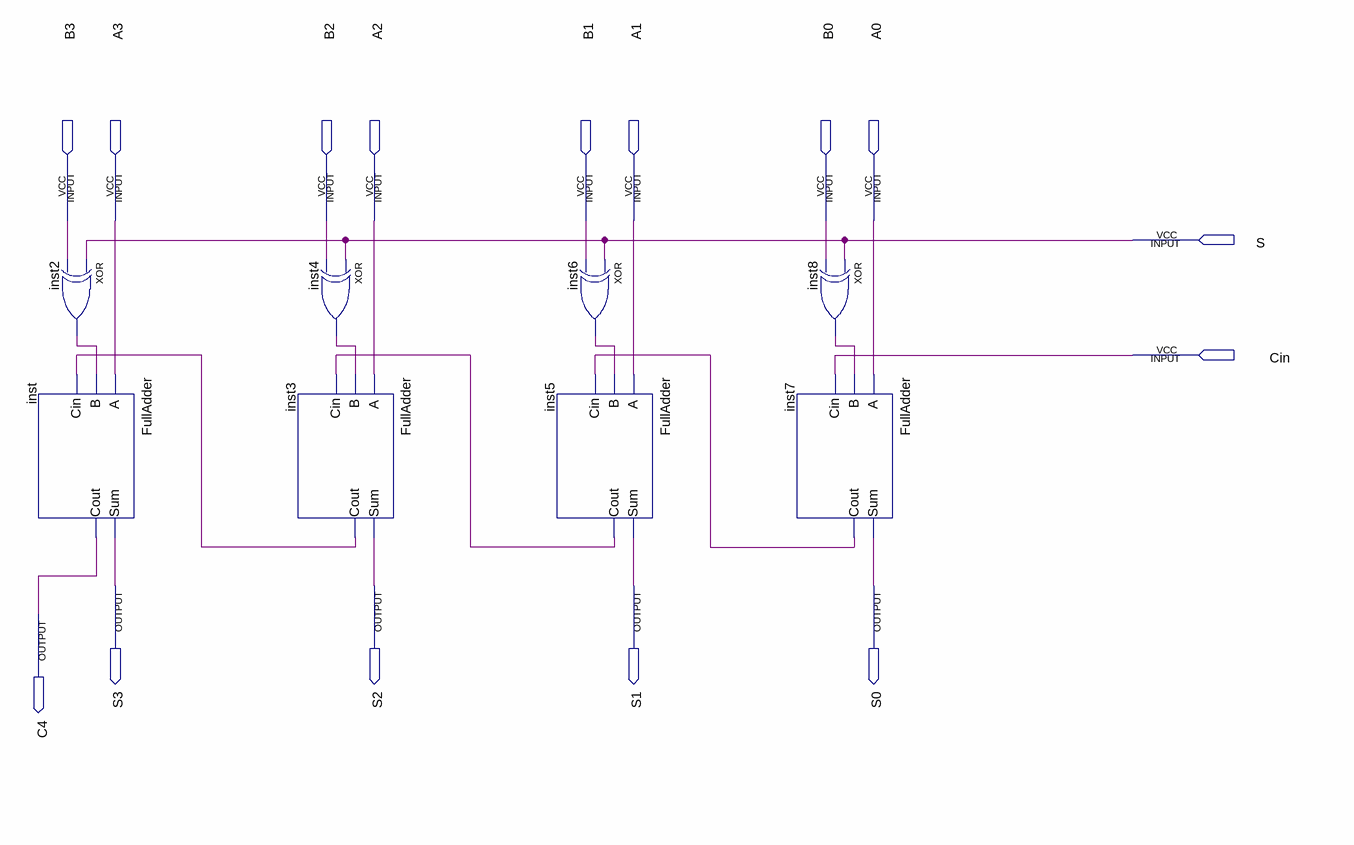
[diagram p0: schematic sheet]
// Quartus schematic SumadorCuatroBits.bdf as structural Verilog: 8 symbols, 15 pins
module SumadorCuatroBits (
  input  B3,
  input  A3,
  input  B2,
  input  A2,
  input  B1,
  input  A1,
  input  B0,
  input  A0,
  input  S,
  input  Cin,
  output S3,
  output S2,
  output S1,
  output S0,
  output C4
);

  wire inst2_out, inst3_cout, inst4_out, inst5_cout, inst6_out, inst7_cout, inst8_out;

  FullAdder inst (.A(A3), .B(inst2_out), .Cin(inst3_cout), .Sum(S3), .Cout(C4));
  xor inst2 (inst2_out, S, B3);
  xor inst4 (inst4_out, S, B2);
  FullAdder inst3 (.A(A2), .B(inst4_out), .Cin(inst5_cout), .Sum(S2), .Cout(inst3_cout));
  xor inst6 (inst6_out, S, B1);
  FullAdder inst5 (.A(A1), .B(inst6_out), .Cin(inst7_cout), .Sum(S1), .Cout(inst5_cout));
  xor inst8 (inst8_out, S, B0);
  FullAdder inst7 (.A(A0), .B(inst8_out), .Cin(Cin), .Sum(S0), .Cout(inst7_cout));
endmodule
